# Altium schematic sheet ultrasonic.SchDoc: =ProjectTitle
size 297 x 209 mm; Address1: Address1; Address2: Address2; Address3: Address3; Address4: Address4; SheetNumber: 4; SheetTotal: 4; Scale: 1:1; DocumentType: Схема электрическая принципиальная
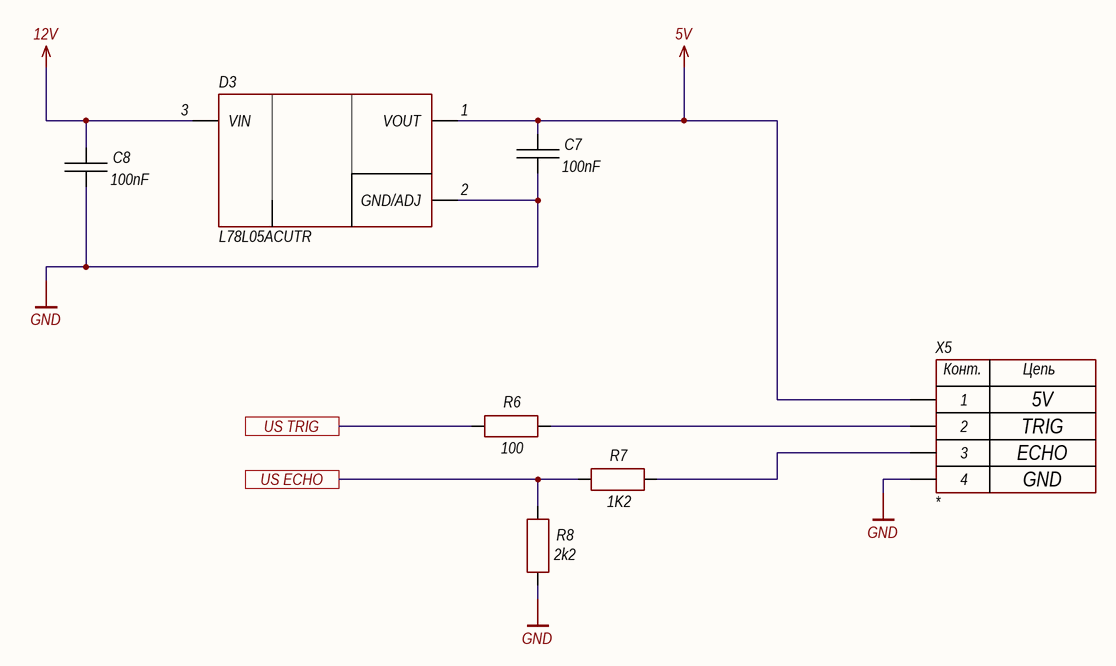
[diagram p0: ultrasonic.SchDoc]

## Parts
C7  100nF  [CH0603C]
C8  100nF  [CH0603C]
D3  L78L05ACUTR  [SOT89_123]
R6  100  [CH0603R]
R7  1K2  [CH0603R]
R8  2k2  [CH0603R]
X5  *  [CON: PBS-4]

## Ports
US ECHO, US TRIG

## Nets
5V: C7.2 D3.1(VOUT) X5.1
12V: C8.2 D3.3(VIN)
GND: C7.1 C8.1 D3.2(GND/ADJ) R8.1 X5.4
US ECHO: R7.1 R8.2 ; port US ECHO
US TRIG: R6.1 ; port US TRIG
NetR6_2: R6.2 X5.2
NetR7_2: R7.2 X5.3

## Notes on the sheet
- 5V
- TRIG
- ECHO
- GND
- Инв. № подл.
- Подп. и дата
- Взам. инв. №
- Инв. № дубл.
- Изм.
- Лист
- № докум.
- Подп.
- Дата
- Копировал
- Формат А4
- (in symbol 4-Connector) Конт.; Цепь

## Library data of the parts
C7 C8 = Capacitor: Manufacturer: *; Model: *; HelpURL: *; ComponentKind: *; Value: 100nF
D3 = L78LxxACUTR: Step-down; Manufacturer: ST Microelectronics; Model: L78L05ACUTR; HelpURL: https://www.st.com/resource/en/datasheet/l78l.pdf; ComponentKind: SOT-89, 100mA
R6-R8 = Resistor: Manufacturer: *; Model: *; HelpURL: *; ComponentKind: *
  R6: Value: 100
  R7: Value: 1K2
  R8: Value: 2k2
X5 = 4-Connector: Model: *; Manufacturer: *; HelpURL: *; ComponentKind: *